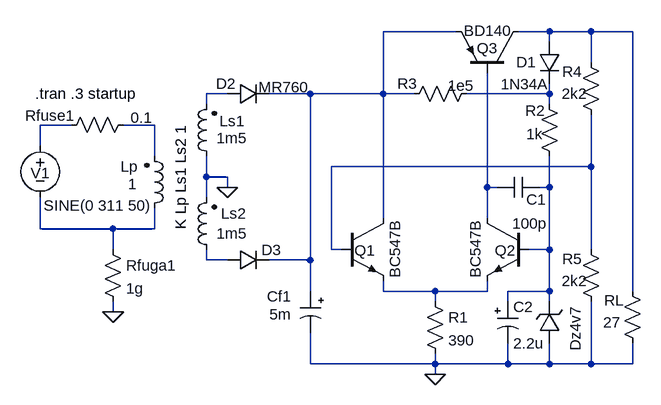
[diagram p0: schematic 3Q_DifLowDropReg.asc]
3Q_DifLowDropReg.asc, the LTspice schematic file:
Version 4
SHEET 1 880 680
WIRE 272 -144 160 -144
WIRE 416 -144 368 -144
WIRE 480 -144 416 -144
WIRE 544 -144 480 -144
WIRE 416 -128 416 -144
WIRE 480 -96 480 -144
WIRE -80 -48 -112 -48
WIRE 48 -48 -16 -48
WIRE 160 -48 160 -144
WIRE 160 -48 48 -48
WIRE 208 -48 160 -48
WIRE 416 -48 416 -64
WIRE 416 -48 288 -48
WIRE -112 -32 -112 -48
WIRE 416 -32 416 -48
WIRE -320 0 -368 0
WIRE -192 0 -240 0
WIRE -368 32 -368 0
WIRE -192 48 -192 0
WIRE 480 64 480 -16
WIRE 480 64 80 64
WIRE -112 80 -112 48
WIRE -80 80 -112 80
WIRE -80 96 -80 80
WIRE 320 96 320 -80
WIRE 336 96 320 96
WIRE 416 96 416 48
WIRE 416 96 400 96
WIRE -112 112 -112 80
WIRE 160 144 160 -48
WIRE 320 144 320 96
WIRE -368 160 -368 112
WIRE -256 160 -368 160
WIRE -192 160 -192 128
WIRE -192 160 -256 160
WIRE -256 192 -256 160
WIRE 80 192 80 64
WIRE 96 192 80 192
WIRE 416 192 416 96
WIRE 416 192 384 192
WIRE 480 192 480 64
WIRE -112 208 -112 192
WIRE -80 208 -112 208
WIRE 48 208 48 -48
WIRE 48 208 -16 208
WIRE 48 256 48 208
WIRE 160 256 160 240
WIRE 240 256 160 256
WIRE 320 256 320 240
WIRE 320 256 240 256
WIRE 416 256 416 192
WIRE 416 256 352 256
WIRE 544 256 544 -144
WIRE 240 272 240 256
WIRE 352 272 352 256
WIRE 416 272 416 256
WIRE -256 288 -256 272
WIRE 48 368 48 320
WIRE 240 368 240 352
WIRE 240 368 48 368
WIRE 352 368 352 336
WIRE 352 368 240 368
WIRE 416 368 416 336
WIRE 416 368 352 368
WIRE 480 368 480 272
WIRE 480 368 416 368
WIRE 544 368 544 336
WIRE 544 368 480 368
WIRE 240 384 240 368
FLAG 240 384 0
FLAG -256 288 0
FLAG -80 96 0
SYMBOL npn2 96 144 R0
WINDOW 0 20 49 Left 0
WINDOW 3 82 2 VRight 0
SYMATTR InstName Q1
SYMATTR Value BC547B
SYMBOL pnp2 368 -80 M270
WINDOW 0 38 64 VLeft 0
WINDOW 3 65 84 VLeft 0
SYMATTR InstName Q3
SYMATTR Value BD140
SYMBOL npn2 384 144 M0
WINDOW 0 20 49 Left 0
WINDOW 3 82 2 VRight 0
SYMATTR InstName Q2
SYMATTR Value BC547B
SYMBOL res 224 256 R0
SYMATTR InstName R1
SYMATTR Value 390
SYMBOL cap 400 80 R90
WINDOW 0 50 4 VBottom 0
WINDOW 3 56 14 VTop 0
SYMATTR InstName C1
SYMATTR Value 100p
SYMBOL zener 432 336 R180
WINDOW 0 -24 -12 VRight 0
WINDOW 3 24 0 Invisible 0
SYMATTR InstName Dz4v7
SYMATTR Value 1N750
SYMATTR Description Diode
SYMATTR Type diode
SYMBOL res 400 -48 R0
WINDOW 0 -21 26 Left 0
WINDOW 3 -20 62 Left 0
SYMATTR InstName R2
SYMATTR Value 1k
SYMBOL res 304 -64 R90
WINDOW 0 16 107 VBottom 0
WINDOW 3 -12 24 VTop 0
SYMATTR InstName R3
SYMATTR Value 1e5
SYMBOL diode 400 -128 R0
WINDOW 0 -35 31 Left 0
WINDOW 3 -59 65 Left 0
SYMATTR InstName D1
SYMATTR Value 1N34A
SYMBOL res 464 -112 R0
WINDOW 0 -28 30 Left 0
WINDOW 3 -29 64 Left 0
SYMATTR InstName R4
SYMATTR Value 2k2
SYMBOL res 464 176 R0
WINDOW 0 -28 30 Left 0
WINDOW 3 -29 64 Left 0
SYMATTR InstName R5
SYMATTR Value 2k2
SYMBOL diode -80 -32 R270
WINDOW 0 16 -2 VTop 0
WINDOW 3 42 87 VBottom 0
SYMATTR InstName D2
SYMATTR Value MR760
SYMBOL diode -80 224 R270
WINDOW 0 16 68 VTop 0
WINDOW 3 66 52 Invisible 0
SYMATTR InstName D3
SYMATTR Value MR760
SYMBOL polcap 64 256 M0
WINDOW 3 45 36 Left 0
WINDOW 0 45 8 Left 0
SYMATTR Value 5m
SYMATTR InstName Cf1
SYMATTR Description Capacitor
SYMATTR Type cap
SYMATTR SpiceLine V=63 Irms=10 Rser=0.017 Lser=0
SYMBOL ind2 -96 64 R180
WINDOW 0 -43 70 Left 0
WINDOW 3 -47 44 Left 0
SYMATTR InstName Ls1
SYMATTR Value 1m5
SYMBOL ind2 -96 208 R180
WINDOW 0 -45 72 Left 0
WINDOW 3 -47 41 Left 0
SYMATTR InstName Ls2
SYMATTR Value 1m5
SYMBOL ind2 -208 144 M180
WINDOW 0 -36 80 Left 0
WINDOW 3 -25 53 Left 0
SYMATTR InstName Lp
SYMATTR Value 1
SYMATTR SpiceLine Rser=1
SYMBOL res -272 176 R0
SYMATTR InstName Rfuga1
SYMATTR Value 1g
SYMBOL voltage -368 16 R0
WINDOW 0 -15 58 Left 0
WINDOW 3 5 108 Left 0
WINDOW 123 0 0 Left 0
WINDOW 39 0 0 Left 0
SYMATTR InstName V1
SYMATTR Value SINE(0 311 50)
SYMBOL res -224 -16 R90
WINDOW 0 17 129 VBottom 0
WINDOW 3 -11 -12 VTop 0
SYMATTR InstName Rfuse1
SYMATTR Value 0.1
SYMBOL res 528 240 R0
WINDOW 0 -28 30 Left 0
WINDOW 3 -29 64 Left 0
SYMATTR InstName RL
SYMATTR Value 27
SYMBOL polcap 336 272 R0
WINDOW 3 24 64 Left 0
SYMATTR InstName C2
SYMATTR Value 2.2u
SYMATTR Description Capacitor
SYMATTR Type cap
SYMATTR SpiceLine V=50 Irms=54m Rser=3 Lser=0 mfg="Nichicon" pn="UPL1H2R2MAH" type="Al electrolytic"
TEXT -376 -48 Left 0 !.tran .3 startup
TEXT -152 0 VRight 0 !K Lp Ls1 Ls2 1

The netlist it stands for:
* 3Q_DifLowDropReg.asc
Q1 N001 N007 N012 0 BC547B
Q3 N002 N008 N001 0 BD140
Q2 N008 N009 N012 0 BC547B
R1 N012 0 390
C1 N009 N008 100p
Dz4v7 0 N009 1N750
R2 N004 N009 1k
R3 N004 N001 1e5
D1 N002 N004 1N34A
R4 N002 N007 2k2
R5 N007 0 2k2
D2 N003 N001 MR760
D3 N011 N001 MR760
Cf1 N001 0 5m V=63 Irms=10 Rser=0.017 Lser=0
Ls1 0 N003 1m5
Ls2 N011 0 1m5
Lp N010 N006 1 Rser=1
Rfuga1 N010 0 1g
V1 N005 N010 SINE(0 311 50)
Rfuse1 N006 N005 0.1
RL N002 0 27
C2 N009 0 2.2u V=50 Irms=54m Rser=3 Lser=0 mfg="Nichicon" pn="UPL1H2R2MAH" type="Al electrolytic"
.model D D
.lib standard.dio
.model NPN NPN
.model PNP PNP
.lib standard.bjt
.tran .3 startup
K Lp Ls1 Ls2 1
.backanno
.end